# Altium project BLDC.PrjPcb (part 2 of 2)

## Sheet BLDC_Page2.SchDoc
size B; Date: Not shown in title block; ApprovedBy: Not shown in title block; CheckedBy: Not shown in title block; Author: Not shown in title block; CompanyName: Not shown in title block; DrawnBy: Erhan YILMAZ; Engineer: Not shown in title block; Organization: Not shown in title block; Address1: Not shown in title block; Address2: Not shown in title block; Address3: Not shown in title block; Address4: Not shown in title block; DocumentNumber: 4; Revision: 1; SheetNumber: 4; SheetTotal: 4; PageSetup: Record=PageOptions|CenterHorizontal=True|CenterVertical=True|PrintScale=1.00|XCorrection=1.00|YCorrection=1.00|PrintKind=0|BorderSize=5000000|LeftOffset=0|BottomOffset=0|Orientation=2|PaperLength=1000|PaperWidth=1000|Scale=100|PaperSource=15|PrintQuality=600|MediaType=1|DitherType=10|PaperKind=Letter|PrintScaleMode=1; LogoLocation: C:\Users\erhan\Desktop\emob_bldc\design\hardware\altium\templates\schematic\Beuth-Logo.bmp; SheetTitle: Power Stage; DesignedBy: Erhan YILMAZ; PRJNAME: Beuth EMOB BLDC Controller Derived from TI TIDA-010056; CurrentTime: Not shown in title block; CurrentDate: Not shown in title block; Time: Not shown in title block; DocumentFullPathAndName: Not shown in title block; DocumentName: Not shown in title block; ModifiedDate: Not shown in title block; ImagePath: Not shown in title block
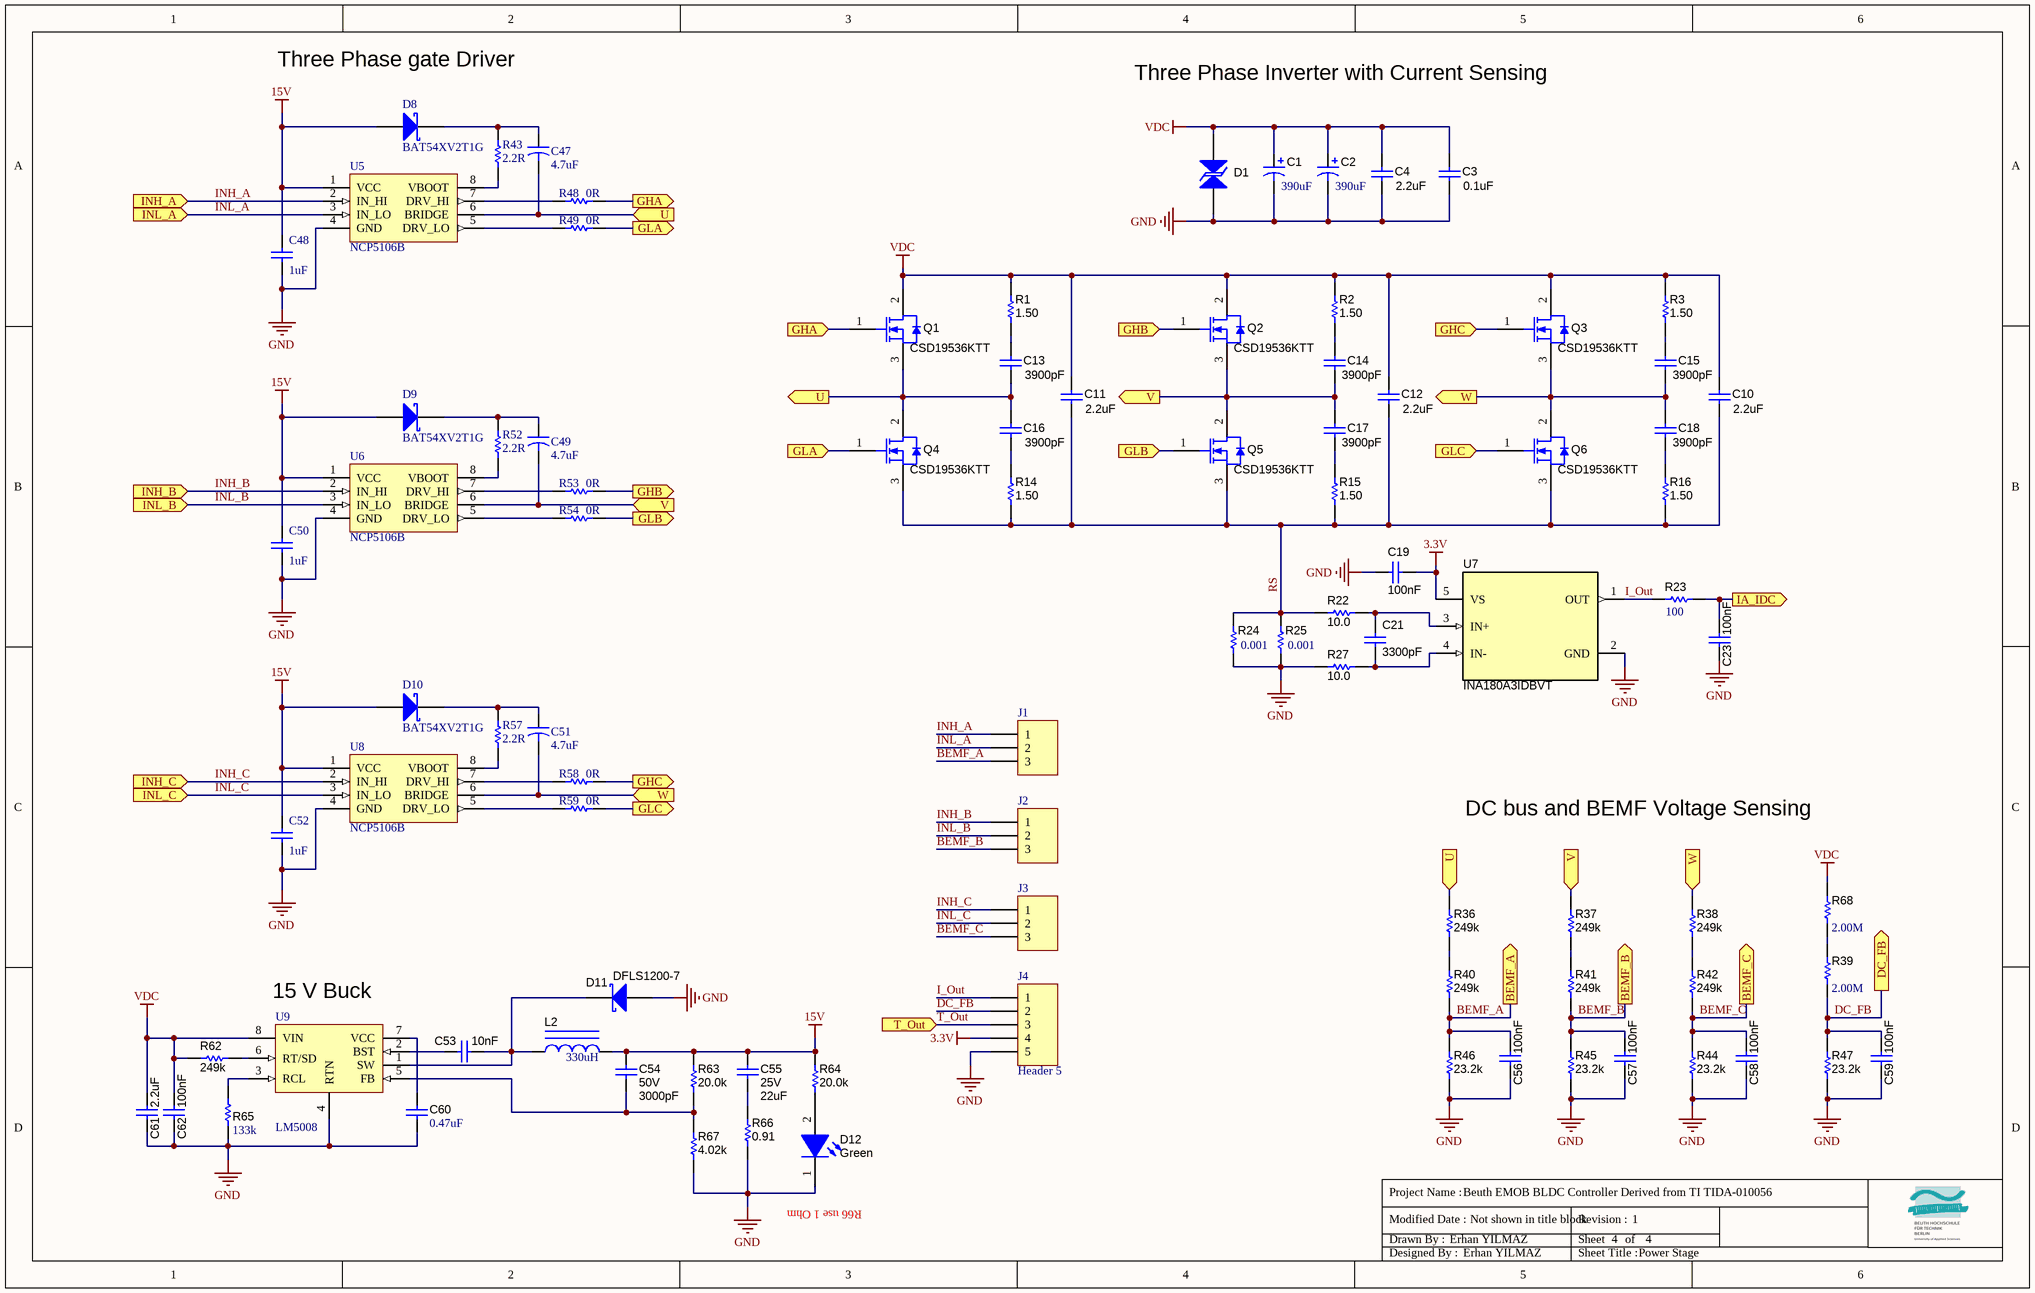
[diagram p2: BLDC_Page2.SchDoc]

### Parts
C1  ValueDisplayed: 390uF  [YXJ_1600x2500]  (hidden comment: EEU-FS2A391)
C2  ValueDisplayed: 390uF  [YXJ_1600x2500]  (hidden comment: EEU-FS2A391)
C3  ValueDisplayed: 0.1uF  [1206]  (hidden comment: C3216X7R2A104K160AA)
C4  ValueDisplayed: 2.2uF  [1206]  (hidden comment: CL31B225KCHSNNE)
C10  ValueDisplayed: 2.2uF  [1206]  (hidden comment: CL31B225KCHSNNE)
C11  ValueDisplayed: 2.2uF  [1206]  (hidden comment: CL31B225KCHSNNE)
C12  ValueDisplayed: 2.2uF  [1206]  (hidden comment: CL31B225KCHSNNE)
C13  ValueDisplayed: 3900pF  [1206]  (hidden comment: 12061C392KAZ2A)
C14  ValueDisplayed: 3900pF  [1206]  (hidden comment: 12061C392KAZ2A)
C15  ValueDisplayed: 3900pF  [1206]  (hidden comment: 12061C392KAZ2A)
C16  ValueDisplayed: 3900pF  [1206]  (hidden comment: 12061C392KAZ2A)
C17  ValueDisplayed: 3900pF  [1206]  (hidden comment: 12061C392KAZ2A)
C18  ValueDisplayed: 3900pF  [1206]  (hidden comment: 12061C392KAZ2A)
C19  ValueDisplayed: 100nF  [0603]  (hidden comment: GRM1885C1H302JA01D)
C21  3300pF  [0603]
C23  ValueDisplayed: 100nF  [0603]  (hidden comment: GRM1885C1H302JA01D)
C47  4.7uF  [0805_HV]
C48  1uF  [0603]
C49  4.7uF  [0805_HV]
C50  1uF  [0603]
C51  4.7uF  [0805_HV]
C52  1uF  [0603]
C53  Cap_F: 10nF  [0603]  (hidden comment: 885012206114)
C54  VDC_V: 50V  ValueDisplayed: 3000pF  [0603]  (hidden comment: CAP, CERM, 3000 pF, 50 V, +/- 5%, C0G/NP0, 0603)
C55  VDC_V: 25V  ValueDisplayed: 22uF  [1210_280]  (hidden comment: C2012X7R1H225K125AC)
C56  ValueDisplayed: 100nF  [0603]  (hidden comment: GRM1885C1H302JA01D)
C57  ValueDisplayed: 100nF  [0603]  (hidden comment: GRM1885C1H302JA01D)
C58  ValueDisplayed: 100nF  [0603]  (hidden comment: GRM1885C1H302JA01D)
C59  ValueDisplayed: 100nF  [0603]  (hidden comment: GRM1885C1H302JA01D)
C60  ValueDisplayed: 0.47uF  [0603]  (hidden comment: CGB2A1X5R1C474K033BC)
C61  ValueDisplayed: 2.2uF  [1206]  (hidden comment: C2012X7R1H225K125AC)
C62  ValueDisplayed: 100nF  [0603]  (hidden comment: GRM1885C1H302JA01D)
D1  SMBJ70CA-13-F  [SMB-Bi]  (value not drawn)
D8  BAT54XV2T1G  [SOD-523]
D9  BAT54XV2T1G  [SOD-523]
D10  BAT54XV2T1G  [SOD-523]
D11  DFLS1200-7  [PowerDI123]
D12  value Green  [WL-SMCW_GREEN]  (hidden comment: LED_A2_K1)
J1  Header 3  [HDR1X3]  (value not drawn)
J2  Header 3  [HDR1X3]  (value not drawn)
J3  Header 3  [HDR1X3]  (value not drawn)
J4  Header 5  [HDR1X5]
L2  ValueDisplayed: 330uH  [SDR0604]  (hidden comment: SDR0604-331KL)
Q1  CSD19536KTT  [KTT0002A]
Q2  CSD19536KTT  [KTT0002A]
Q3  CSD19536KTT  [KTT0002A]
Q4  CSD19536KTT  [KTT0002A]
Q5  CSD19536KTT  [KTT0002A]
Q6  CSD19536KTT  [KTT0002A]
R1  ValueDisplayed: 1.50  [1206]  (hidden comment: CRCW12061R50FKEA)
R2  ValueDisplayed: 1.50  [1206]  (hidden comment: CRCW12061R50FKEA)
R3  ValueDisplayed: 1.50  [1206]  (hidden comment: CRCW12061R50FKEA)
R14  ValueDisplayed: 1.50  [1206]  (hidden comment: CRCW12061R50FKEA)
R15  ValueDisplayed: 1.50  [1206]  (hidden comment: CRCW12061R50FKEA)
R16  ValueDisplayed: 1.50  [1206]  (hidden comment: CRCW12061R50FKEA)
R22  ValueDisplayed: 10.0  [0603]  (hidden comment: CRCW040210R0FKED)
R23  ValueDisplayed: 100  [0603]  (hidden comment: ERJ-2GEJ101X)
R24  ValueDisplayed: 0.001  [CRE2512-R1_R4]  (hidden comment: CRE2512-FZ-R001E-3)
R25  value 0.001  [CRE2512-R1_R4]  (hidden comment: CRE2512-FZ-R001E-3)
R27  ValueDisplayed: 10.0  [0603]  (hidden comment: CRCW040210R0FKED)
R36  ValueDisplayed: 249k  [0603]  (hidden comment: RC0603FR-07249KL)
R37  ValueDisplayed: 249k  [0603]  (hidden comment: RC0603FR-07249KL)
R38  ValueDisplayed: 249k  [0603]  (hidden comment: RC0603FR-07249KL)
R39  ValueDisplayed: 2.00M  [0603]  (hidden comment: CRCW06032M00FKED)
R40  ValueDisplayed: 249k  [0603]  (hidden comment: RC0603FR-07249KL)
R41  ValueDisplayed: 249k  [0603]  (hidden comment: RC0603FR-07249KL)
R42  ValueDisplayed: 249k  [0603]  (hidden comment: RC0603FR-07249KL)
R43  2.2R  [0603]
R44  ValueDisplayed: 23.2k  [0603]  (hidden comment: RC0603FR-0723K2L)
R45  ValueDisplayed: 23.2k  [0603]  (hidden comment: RC0603FR-0723K2L)
R46  ValueDisplayed: 23.2k  [0603]  (hidden comment: RC0603FR-0723K2L)
R47  ValueDisplayed: 23.2k  [0603]  (hidden comment: RC0603FR-0723K2L)
R48  0R  [0603]
R49  0R  [0603]
R52  2.2R  [0603]
R53  0R  [0603]
R54  0R  [0603]
R57  2.2R  [0603]
R58  0R  [0603]
R59  0R  [0603]
R62  ValueDisplayed: 249k  [0603]  (hidden comment: RC0603FR-07249KL)
R63  ValueDisplayed: 20.0k  [0603]  (hidden comment: CRCW060320K0FKED)
R64  ValueDisplayed: 20.0k  [0603]  (hidden comment: CRCW060320K0FKED)
R65  ValueDisplayed: 133k  [0603]  (hidden comment: AC0402FR-07133KL)
R66  ValueDisplayed: 0.91  [0603]  (hidden comment: ERJ-2BQFR91X)
R67  ValueDisplayed: 4.02k  [0603]  (hidden comment: RC0402FR-074K02L)
R68  ValueDisplayed: 2.00M  [0603]  (hidden comment: CRCW06032M00FKED)
U5  NCP5106B  [SO-8_L]
U6  NCP5106B  [SO-8_L]
U7  PartNumber: INA180A3IDBVT  [sot23-5]  (hidden comment: INA180A3IDBV)
U8  NCP5106B  [SO-8_L]
U9  LM5008  [VSSOP8]

### Ports
BEMF_A (out), BEMF_B (out), BEMF_C (out), DC_FB (out), GHA (in), GHA (out), GHB (in), GHB (out), GHC (in), GHC (out), GLA (in), GLA (out), GLB (in), GLB (out), GLC (in), GLC (out), IA_IDC (out), INH_A (in), INH_B (in), INH_C (in), INL_A (in), INL_B (in), INL_C (in), T_Out (in), U (in), U (out), V (in), V (out), W (in), W (out)

### Nets
3.3V: C19.2 J4.4 U7.5(VS)
15V: C48.2 C50.2 C52.2 C54.1 C55.1 D8.1(A) D9.1(A) D10.1(A) L2.2 R63.2 R64.2 U5.1(VCC) U6.1(VCC) U8.1(VCC)
GND: C1.2(-) C2.2(-) C3.2 C4.2 C19.1 C23.2 C48.1 C50.1 C52.1 C56.2 C57.2 C58.2 C59.2 C60.1 C61.2 C62.2 D1.1 D11.2(A) D12.1(K) J4.5 R24.1 R25.1 R27.1 R44.1 R45.1 R46.1 R47.1 R65.1 R66.1 R67.1 U5.4(GND) U6.4(GND) U7.2(GND) U8.4(GND) U9.4(RTN)
VDC: C1.1(+) C2.1(+) C3.1 C4.1 C10.1 C11.1 C12.1 C61.1 C62.1 D1.2 Q1.2(D) Q2.2(D) Q3.2(D) R1.2 R2.2 R3.2 R62.2 R68.2 U9.8(VIN)
BEMF_A: C56.1 J1.3 R40.1 R46.2 ; port BEMF_A
BEMF_B: C57.1 J2.3 R41.1 R45.2 ; port BEMF_B
BEMF_C: C58.1 J3.3 R42.1 R44.2 ; port BEMF_C
DC_FB: C59.1 J4.2 R39.1 R47.2 ; port DC_FB
GHA: Q1.1(G) R48.1 ; port GHA
GHB: Q2.1(G) R53.1 ; port GHB
GHC: Q3.1(G) R58.1 ; port GHC
GLA: Q4.1(G) R49.1 ; port GLA
GLB: Q5.1(G) R54.1 ; port GLB
GLC: Q6.1(G) R59.1 ; port GLC
I_Out: J4.1 R23.1 U7.1(OUT)
IA_IDC: C23.1 R23.2 ; port IA_IDC
INH_A: J1.1 U5.2(IN_HI) ; port INH_A
INH_B: J2.1 U6.2(IN_HI) ; port INH_B
INH_C: J3.1 U8.2(IN_HI) ; port INH_C
INL_A: J1.2 U5.3(IN_LO) ; port INL_A
INL_B: J2.2 U6.3(IN_LO) ; port INL_B
INL_C: J3.2 U8.3(IN_LO) ; port INL_C
RS: C10.2 C11.2 C12.2 Q4.3(S) Q5.3(S) Q6.3(S) R14.1 R15.1 R16.1 R22.1 R24.2 R25.2
T_Out: J4.3 ; port T_Out
U: C13.2 C16.1 C47.2 Q1.3(S) Q4.2(D) R36.2 U5.6(BRIDGE) ; port U
V: C14.2 C17.1 C49.2 Q2.3(S) Q5.2(D) R37.2 U6.6(BRIDGE) ; port V
W: C15.2 C18.1 C51.2 Q3.3(S) Q6.2(D) R38.2 U8.6(BRIDGE) ; port W
NetC13_1: C13.1 R1.1
NetC14_1: C14.1 R2.1
NetC15_1: C15.1 R3.1
NetC16_2: C16.2 R14.2
NetC17_2: C17.2 R15.2
NetC18_2: C18.2 R16.2
NetC21_1: C21.1 R22.2 U7.3(IN+)
NetC21_2: C21.2 R27.2 U7.4(IN-)
NetC47_1: C47.1 D8.2(K) R43.2
NetC49_1: C49.1 D9.2(K) R52.2
NetC51_1: C51.1 D10.2(K) R57.2
NetC53_1: C53.1 U9.2(BST)
NetC53_2: C53.2 D11.1(K) L2.1 U9.1(SW)
NetC54_2: C54.2 R63.1 R67.2 U9.5(FB)
NetC55_2: C55.2 R66.2
NetC60_2: C60.2 U9.7(VCC)
NetD12_2: D12.2(A) R64.1
NetR36_1: R36.1 R40.2
NetR37_1: R37.1 R41.2
NetR38_1: R38.1 R42.2
NetR39_2: R39.2 R68.1
NetR43_1: R43.1 U5.8(VBOOT)
NetR48_2: R48.2 U5.7(DRV_HI)
NetR49_2: R49.2 U5.5(DRV_LO)
NetR52_1: R52.1 U6.8(VBOOT)
NetR53_2: R53.2 U6.7(DRV_HI)
NetR54_2: R54.2 U6.5(DRV_LO)
NetR57_1: R57.1 U8.8(VBOOT)
NetR58_2: R58.2 U8.7(DRV_HI)
NetR59_2: R59.2 U8.5(DRV_LO)
NetR62_1: R62.1 U9.6(RT/SD)
NetR65_2: R65.2 U9.3(RCL)

### Notes on the sheet
- Three Phase gate Driver
- Three Phase Inverter with Current Sensing
- DC bus and BEMF Voltage Sensing
- (near U9) 15 V Buck
- R66 use 1 Ohm
- Project Name :
- Modified Date :
- Drawn By :
- Revision :
- Sheet
- of
- Designed By :
- Sheet Title :

### Library data of the parts
C1 C2 = CMP-0009783-2: CAP ALUM 390UF 20% 100V THRUHOLE; Manufacturer: Panasonic Electronic Components; TaMin_C: -40°C; ESR_ohm: 0.025; Polarized: Y; SizeAreaWB_mm2: 324; Value1: 0.025 ohm; U/M: EA; TaMax_C: 105°C; SizeZ_mm: 27; SizeX_mm: 16; Cap_Case: 16x257; SizeArea_mm2: 256; CompType: Capacitor; AEC Qualified: N; Cap_F: 390µF; IRMS_A: 2.5A; AEC Category: Q200; Publisher: Texas Instruments; Supplier 2: Newark; Supplier 3: Farnell; RoHS: Y; MountType: TH; Value: 390uF; Supplier 1: Digi-Key; PackageReference: D16xL27mm; Tolerance_%: 20%; SizeY_mm: 16; Value2: 100V; LatestRevisionDate: 2017-03-09; PartNumber: EEU-FS2A391; Series: YXJ; VDC_V: 100V; ComponentLink1Description: Datasheet link; AEC Grade: N/A; Supplier Part Number 1: PCE5237-ND; Technology: AL; ComponentLink1URL: http://www.rubycon.co.jp/en/catalog/e_pdfs/aluminum/e_yxj.pdf; Parameter 1: *
C3 = CMP-0008709-2: CAP, CERM, 0.1 uF, 100 V, +/- 10%, X7R, 1206; Manufacturer: TDK; TaMin_C: -55°C; ESR_ohm: 0.030343; Polarized: N; SizeAreaWB_mm2: 10.92; Value1: 0.030343 ohm; U/M: EA; Value: 0.1uF; TaMax_C: 125°C; SizeZ_mm: 1.8; SizeX_mm: 3.2; SizeY_mm: 1.6; Cap_Case: 1206_180; Value2: 100V; SizeArea_mm2: 5.12; Cap_F: 100nF; IRMS_A: 1.33802A; AEC Category: Q200; Supplier Part Number 2: 810-C3216X7R2A104K160AA; Publisher: Texas Instruments; Supplier 2: Mouser; TempCo: X7R; Published: 2008-06-19; RoHS: Y; MountType: SMT; Supplier 1: Digi-Key; PackageReference: 1206; Tolerance_%: 10%; CompType: Capacitor; LatestRevisionDate: 2017-03-09; PartNumber: C3216X7R2A104K160AA; AEC Qualified: N; VDC_V: 100V; ComponentLink1Description: Datasheet link; AEC Grade: N/A; Supplier Part Number 1: 445-1377-1-ND; Technology: Ceramic; ComponentLink1URL: https://product.tdk.com/en/search/capacitor/ceramic/mlcc/info?part_no=C3216X7R2A104K160AA
C4 C10-C12 = CMP-0008756-2: CAP CER 2.2UF 100V X7R 1206; Manufacturer: Samsung Electro-Mechanics; TaMin_C: -55°C; Polarized: N; SizeAreaWB_mm2: 10.92; Value1: Unknown; U/M: EA; TaMax_C: 125°C; Tolerance_%: 10%; SizeZ_mm: 1.35; SizeX_mm: 3.2; SizeY_mm: 1.6; SizeArea_mm2: 5.12; AEC Category: Q200; Publisher: Texas Instruments; Supplier 2: Mouser; TempCo: X7R; Supplier 3: Farnell; Published: 2008-06-19; RoHS: Y; MountType: SMT; Value: 2.2uF; Supplier 1: Digi-Key; PackageReference: 1206; Cap_Case: 1206; Value2: 100V; CompType: Capacitor; LatestRevisionDate: 2017-03-09; PartNumber: CL31B225KCHSNNE; AEC Qualified: ?; Cap_F: 2.2uF; VDC_V: 100V; ComponentLink1Description: Datasheet link; Supplier Part Number 1: 1276-3138-1-ND; Technology: Ceramic; ComponentLink1URL: http://www.yageo.com/documents/recent/UPY-GPHC_X7R_6.3V-to-50V_7.pdf
C13-C18 = CMP-0008756-2: CAP CER 3900PF 100V X7R 1206; Manufacturer: AVX Corporation; TaMin_C: -55°C; Polarized: N; SizeAreaWB_mm2: 10.92; Value1: Unknown; U/M: EA; TaMax_C: 125°C; Tolerance_%: 10%; SizeZ_mm: 1.35; SizeX_mm: 3.2; SizeY_mm: 1.6; SizeArea_mm2: 5.12; Cap_F: 3.9nF; AEC Category: Q200; Publisher: Texas Instruments; Supplier 2: Mouser; TempCo: X7R; Supplier 3: Farnell; Published: 2008-06-19; RoHS: Y; MountType: SMT; Value: 3900pF; Supplier 1: Digi-Key; PackageReference: 1206; Cap_Case: 1206; Value2: 100V; CompType: Capacitor; LatestRevisionDate: 2017-03-09; PartNumber: 12061C392KAZ2A; AEC Qualified: ?; VDC_V: 100V; ComponentLink1Description: Datasheet link; Supplier Part Number 1: 478-6364-1-ND; Technology: Ceramic; ComponentLink1URL: http://www.yageo.com/documents/recent/UPY-GPHC_X7R_6.3V-to-50V_7.pdf
C19 C23 C56-C59 C62 = CMP-0007207-4: CAP, CERM, 100 nF, 100 V, +/- 5%, C0G/NP0, 0603; Manufacturer: MuRata; TaMin_C: -55°C; Polarized: N; SizeAreaWB_mm2: 4.68; Value1: Unknown; U/M: EA; Value: 3000pF; TaMax_C: 125°C; SizeZ_mm: 1; SizeX_mm: 1.6; SizeY_mm: 0.8; Value2: 100V; SizeArea_mm2: 1.28; Cap_F: 3nF; AEC Category: Q200; Supplier Part Number 2: 81-GRM1885C1H302JA1D; Publisher: Texas Instruments; Supplier 2: Mouser; TempCo: C0G/NP0; Published: 2008-06-19; RoHS: Y; MountType: SMT; Supplier 1: Digi-Key; PackageReference: 0603; Tolerance_%: 5%; Cap_Case: 0603; CompType: Capacitor; LatestRevisionDate: 2017-03-09; PartNumber: GRM1885C1H302JA01D; AEC Qualified: ?; VDC_V: 100V; ComponentLink1Description: Datasheet link; Supplier Part Number 1: GRM1885C1H302JA01D-ND; Technology: Ceramic; ComponentLink1URL: http://search.murata.co.jp/Ceramy/PnsearchViewAction.do?HnOFG=ON&HnNFG=ON&SEL_CNT=50&sLang=en&sKey=GRM1885C1H302JA01D&x=9&y=9&search=startwith
C21 = CMP-0006688-2: CAP, CERM, 3300 pF, 50 V, +/- 10%, X7R, 0603; Manufacturer: MuRata; PartNumber: GRM155R71H332KA01D; TaMin_C: -55°C; Polarized: N; SizeAreaWB_mm2: 3; Value1: Unknown; U/M: EA; TaMax_C: 125°C; SizeZ_mm: 0.6; SizeX_mm: 1; SizeY_mm: 0.5; Value2: 50V; Cap_F: 3.3nF; AEC Category: Q200; Supplier Part Number 2: 81-GRM36X332K50; Publisher: Texas Instruments; Supplier 2: Mouser; TempCo: X7R; Published: 2008-06-19; RoHS: Y; MountType: SMT; Value: 3300pF; Supplier 1: Digi-Key; PackageReference: 0402; Tolerance_%: 10%; Cap_Case: 0603; SizeArea_mm2: 0.5; CompType: Capacitor; LatestRevisionDate: 2017-03-09; AEC Qualified: ?; VDC_V: 50V; ComponentLink1Description: Datasheet link; Supplier Part Number 1: 490-3248-1-ND; Technology: Ceramic; ValueDisplayed: 3300pF; ComponentLink1URL: http://search.murata.co.jp/Ceramy/PnsearchViewAction.do?HnOFG=ON&HnNFG=ON&SEL_CNT=50&sLang=en&sKey=GRM155R71H332KA01D&x=9&y=9&search=startwith
C47 C49 C51 = Cap2: 4.7uF 25V Tantalum SMD Capacitor; Manufacturer: AVX; Published: 23-Sep-2002; PackageReference: CAPR5-4X5; Publisher: Altium Limited; PackageDescription: Capacitor; 2 Leads; Value: 4.7uF; Buy Link: https://www.mouser.de/ProductDetail/AVX/TCJD475M100R0250; Datasheet: https://www.mouser.de/datasheet/2/40/tcj-776064.pdf
C48 = Cap Semi: 1uF %10 35V 0603; Published: 8-Jun-2000; LatestRevisionDate: 29-May-2009; LatestRevisionNote: IPC-7351 Footprint Added.; PackageReference: 0603; Publisher: Altium Limited; PackageDescription: Chip Capacitor; Value: 1uF
C50 C52 = Cap Semi: 1uF %10 35V  0603; Published: 8-Jun-2000; LatestRevisionDate: 29-May-2009; LatestRevisionNote: IPC-7351 Footprint Added.; PackageReference: 0603; Publisher: Altium Limited; PackageDescription: Chip Capacitor; Value: 1uF
C53 = CMP-0079993-1: CAP, CERM, 0.01 µF, 100 V,+/- 10%, X7R, 0603; Manufacturer: Wurth Elektronik; TaMin_C: -55°C; Polarized: N; SizeAreaWB_mm2: 4.68; U/M: EA; Value: 0.01uF; TaMax_C: 105°C; SizeZ_mm: 1; SizeX_mm: 1.6; SizeY_mm: 0.8; Value2: 100V; SizeArea_mm2: 1.28; AEC Category: Q200; ValueDisplayed: 0.01µF; ComponentLink1URL: http://katalog.we-online.de/pbs/datasheet/885012206114.pdf; Supplier Part Number 2: 2812368; Supplier 2: Farnell; TempCo: X7R; RoHS: Y; MountType: SMT; Supplier 1: Newark; PackageReference: 0603; Tolerance_%: 10%; Cap_Case: 0603; CompType: Capacitor; PartNumber: 885012206114; AEC Qualified: N; VDC_V: 100V; ComponentLink1Description: Datasheet link; AEC Grade: N/A; Supplier Part Number 1: 45AC8565; Technology: Ceramic
C54 = CMP-0007207-4: Manufacturer: MuRata; PartNumber: GRM1885C1H302JA01D; TaMin_C: -55°C; Polarized: N; SizeAreaWB_mm2: 4.68; Value1: Unknown; U/M: EA; Value: 3000pF; TaMax_C: 125°C; SizeZ_mm: 1; SizeX_mm: 1.6; SizeY_mm: 0.8; SizeArea_mm2: 1.28; Cap_F: 3nF; AEC Category: Q200; Supplier Part Number 2: 81-GRM1885C1H302JA1D; Publisher: Texas Instruments; Supplier 2: Mouser; TempCo: C0G/NP0; Published: 2008-06-19; RoHS: Y; MountType: SMT; Supplier 1: Digi-Key; PackageReference: 0603; Tolerance_%: 5%; Cap_Case: 0603; Value2: 50V; CompType: Capacitor; LatestRevisionDate: 2017-03-09; AEC Qualified: ?; ComponentLink1Description: Datasheet link; Supplier Part Number 1: GRM1885C1H302JA01D-ND; Technology: Ceramic; ComponentLink1URL: http://search.murata.co.jp/Ceramy/PnsearchViewAction.do?HnOFG=ON&HnNFG=ON&SEL_CNT=50&sLang=en&sKey=GRM1885C1H302JA01D&x=9&y=9&search=startwith
C55 = CMP-0007877-2: CAP, CERM, 22 uF, 25 V, +/- 10%, X7R, 1210; Manufacturer: TDK; TaMin_C: -55°C; ESR_ohm: 3.66m; Polarized: N; SizeAreaWB_mm2: 6.75; Value1: 0.00366 ohm; U/M: EA; Value: 22uF; TaMax_C: 125°C; SizeZ_mm: 1.45; SizeX_mm: 2; SizeY_mm: 1.25; Cap_Case: 1210; SizeArea_mm2: 2.5; Cap_F: 22µF; IRMS_A: 3.41207A; AEC Category: Q200; Supplier Part Number 2: 04X3290; Publisher: Texas Instruments; Supplier 2: Newark; Supplier Part Number 3: 2346945; TempCo: X7R; Supplier 3: Farnell; Published: 2008-06-19; RoHS: Y; MountType: SMT; Supplier 1: Digi-Key; PackageReference: 0805; Tolerance_%: 10%; Value2: 25V; CompType: Capacitor; LatestRevisionDate: 2017-03-09; PartNumber: C2012X7R1H225K125AC; AEC Qualified: N; ComponentLink1Description: Datasheet link; AEC Grade: N/A; Supplier Part Number 1: 445-5968-1-ND; Technology: Ceramic; ComponentLink1URL: https://product.tdk.com/en/search/capacitor/ceramic/mlcc/info?part_no=C2012X7R1H225K125AC
C60 = CMP-0006600-2: CAP CER 0.47UF 16V X5R 0603; Manufacturer: TDK Corporation; TaMin_C: -55°C; Polarized: N; SizeAreaWB_mm2: 3; Value1: Unknown; U/M: EA; TaMax_C: 85°C; Tolerance_%: 10%; SizeZ_mm: 0.6; SizeX_mm: 1; SizeY_mm: 0.5; Cap_F: 470nF; AEC Category: Q200; Publisher: Texas Instruments; TempCo: X5R; Published: 2008-06-19; RoHS: Y; MountType: SMT; Value: 0.47uF; PackageReference: 0402; Cap_Case: 0603; Value2: 16V; SizeArea_mm2: 0.5; CompType: Capacitor; LatestRevisionDate: 2017-03-09; PartNumber: CGB2A1X5R1C474K033BC; AEC Qualified: ?; VDC_V: 16V; ComponentLink1Description: Datasheet link; Technology: Ceramic; ComponentLink1URL: http://psearch.murata.com/capacitor/product/GRM155R61C474KE01%23.pdf; Supplier 1: Digikey; Supplier Part Number 1: 445-13183-1-ND
C61 = CMP-0007877-2: CAP, CERM, 2.2 uF, 100 V, +/- 10%, X7R, 1206; Manufacturer: TDK; TaMin_C: -55°C; ESR_ohm: 3.66m; Polarized: N; SizeAreaWB_mm2: 6.75; Value1: 0.00366 ohm; U/M: EA; Value: 2.2uF; TaMax_C: 125°C; SizeZ_mm: 1.45; SizeX_mm: 2; SizeY_mm: 1.25; Value2: 100V; SizeArea_mm2: 2.5; Cap_F: 2.2µF; IRMS_A: 3.41207A; AEC Category: Q200; Supplier Part Number 2: 04X3290; Publisher: Texas Instruments; Supplier 2: Newark; Supplier Part Number 3: 2346945; TempCo: X7R; Supplier 3: Farnell; Published: 2008-06-19; RoHS: Y; MountType: SMT; Supplier 1: Digi-Key; PackageReference: 1206; Tolerance_%: 10%; Cap_Case: 1206; CompType: Capacitor; LatestRevisionDate: 2017-03-09; PartNumber: C2012X7R1H225K125AC; AEC Qualified: N; VDC_V: 100V; ComponentLink1Description: Datasheet link; AEC Grade: N/A; Supplier Part Number 1: 445-5968-1-ND; Technology: Ceramic; ComponentLink1URL: https://product.tdk.com/en/search/capacitor/ceramic/mlcc/info?part_no=C2012X7R1H225K125AC
D1 = CMP-0005587-3: Diode, TVS, Bi, 70 V, SMB; Manufacturer: Diodes Inc.; Value: 70V; AEC Category: Q101; SizeX_mm: 5.6; SizeY_mm: 3.81; Ppk: 600W; SizeZ_mm: 2.6; SizeArea_mm2: 21.336; SizeAreaWB_mm2: 44.156; PackageReference: SMB; PartNumber: SMBJ70CA-13-F; AEC Qualified: ?; ComponentLink1URL: http://www.diodes.com/datasheets/ds19002.pdf; CompType: TVS; RoHS: Y; MountType: SMT; Value1: 600W; VRWM: 70V; ComponentLink1Description: Datasheet link
D8-D10 = D Schottky: Schottky Diode; Published: 8-Jun-2000; LatestRevisionDate: 17-Jul-2002; LatestRevisionNote: Re-released for DXP Platform.; PackageReference: SMB; Publisher: Altium Limited; PackageDescription: DO-214-AA/SMB; 2 C-Bend Leads; Body 5.3 x 3.6 mm, inc. leads (LxW); Code_JEDEC: DO-214-AA; Value: BAT54XV2T1G
D11 = CMP-0028517-1: Diode, Schottky, 200 V, 1 A, PowerDI123; Manufacturer: Diodes Inc.; Io_A: 1A; Green_Lifecycle: Active; SizeAreaWB_mm2: 13.066; Vr_V: 200V; Green_REACh: Passed; TJmax_C: 175°C; U/M: EA; Value: 200V; SizeZ_mm: 0.98; SizeX_mm: 3.7; SizeY_mm: 1.78; Vf_V: 8.5dV; Value2: 0.85V; SizeArea_mm2: 6.586; AEC Category: Q101; RJC_CperW: 7; ComponentLink1URL: http://www.diodes.com/datasheets/ds30628.pdf; Supplier Part Number 2: 621-DFLS1200-F; Publisher: Texas Instruments; Supplier 2: Mouser; Supplier Part Number 3: 1713890; Supplier 3: Farnell; Published: 2008-06-26; RoHS: Y; Value1: 1A; MountType: SMT; Green_EU RoHS-2: Passed; Supplier 1: Digi-Key; Green_EU RoHS: Passed with Exemption; PackageReference: PowerDI123; CompType: Diode; Type: Schottky; LatestRevisionDate: 2017-05-08; PartNumber: DFLS1200-7; AEC Qualified: ?; ComponentLink1Description: Datasheet link; Supplier Part Number 1: DFLS1200DICT-ND
D12 = CMP-0002905-1: LED, Green, SMD; Manufacturer: Wurth Elektronik; PartNumber: 150060GS75000; Type: InGaN; Vf_V: 3.2V; Io_A: 20mA; Tjmax_C: 85°C; Value1: W; Angle: 140; U/M: EA; CompType: LED; MountType: SMT; RoHS: Y; PackageReference: LED_0603; Value2: 3.2V; Color: Green; Published: 2008-07-11; Publisher: Texas Instruments; ComponentLink1URL: http://katalog.we-online.de/led/datasheet/150060GS75000.pdf; ComponentLink1Description: Datasheet link; LatestRevisionDate: 2017-03-09; Supplier 1: Digi-Key; Supplier Part Number 1: 732-4971-1-ND; Supplier 2: Newark; Supplier Part Number 2: 95W3794; Supplier 3: Mouser; Supplier Part Number 3: 710-150060GS75000
J1-J3 = Header 3: Header, 3-Pin; LatestRevisionDate: 17-Jul-2002; LatestRevisionNote: Re-released for DXP Platform.; Publisher: Altium Limited
J4 = Header 5: Header, 5-Pin; LatestRevisionDate: 17-Jul-2002; LatestRevisionNote: Re-released for DXP Platform.; Publisher: Altium Limited
L2 = CMP-0056063-1: Inductor, Drum Core, Ferrite, 330 uH, 0.27 A, 2.25 ohm, SMD; Manufacturer: Bourns; Isat: 0.42A @ 10% inductance drop; Irms: 0.27A @ 40C rise; Green_Lifecycle: Active; SizeAreaWB_mm2: 60.84; DCR_ohm: 2.25; Green_REACh: Passed; Value: 330uH; Imax_A: 270mA; SizeZ_mm: 4.8; SizeX_mm: 5.8; Value2: 0.27A; SizeArea_mm2: 33.64; Ind_H: 330µH; AEC Category: Q200; ComponentLink1URL: http://www.bourns.com/data/global/pdfs/SDR0604.pdf; Supplier Part Number 2: 1828017; Publisher: Texas Instruments; Supplier 2: Farnell; Published: 2008-06-26; RoHS: Y; Value1: 2.25 ohm; Material: Ferrite; MountType: SMT; Green_EU RoHS-2: Incomplete; Supplier 1: Mouser; Green_EU RoHS: Passed; PackageReference: 5.8x4.8x5.8mm; SizeY_mm: 5.8; CompType: Inductor; LatestRevisionDate: 2017-06-02; PartNumber: SDR0604-331KL; AEC Qualified: ?; ComponentLink1Description: Datasheet link; Supplier Part Number 1: 652-SDR0604-331KL; Technology: Drum Core
Q1-Q6 = CMP-0000966-3: MOSFET, N-CH, 100 V, 200 A, KTT0002A (TO-263-2); Alternate Manufacturer: None; Manufacturer: Texas Instruments; SizeZ_mm: 4.7; ChType: N; Value2: 118 nC; VdsMax_V: 100V; SizeX_mm: 14.3; SizeY_mm: 10.16; Vgs_V: 20V; QgTyp_nC: 118; Value: 100V; SizeArea_mm2: 145.288; AEC Category: Q101; IdsMax_A: 200A; SizeAreaWB_mm2: 198.208; Supplier 2: Mouser; Supplier 1: Digi-Key; Supplier Part Number 1: 296-41136-1-ND; Supplier Part Number 2: 595-CSD19536KTT; PartNumber: CSD19536KTT; ComponentLink1Description: Datasheet link; CompType: MOSFET; AEC Qualified: N; RoHS: Y; PackageReference: KTT0002A; MountType: SMT; ComponentLink1URL: http://www.ti.com/lit/ds/symlink/csd19536ktt.pdf
R1-R3 R14-R16 = CMP-0016763-3: RES, 1.50, 1%, 0.25 W, AEC-Q200 Grade 0, 1206; Manufacturer: Vishay-Dale; Power_W: 250mW; TempCo: 100 ppm/C; Value_Code: 1R50; Value: 1.50; EIA_Code: E96; Res_ohm: 1.5; SizeX_mm: 3.2; SizeY_mm: 1.6; SizeZ_mm: 1.35; Value2: 0.25W; SizeArea_mm2: 5.12; AEC Qualified: Y; VDC_V: 200V; AEC Category: Q200; AEC Grade: 0; Supplier Part Number 2: 71-CRCW1206-1.5-E3; Supplier 2: Mouser; Supplier Part Number 3: 1260858; Supplier 3: Farnell; RoHS: E; Value1: 1%; MountType: SMT; Supplier 1: Newark; PackageReference: 1206; Tolerance_%: 1%; CompType: Resistor; PartNumber: CRCW12061R50FKEA; ComponentLink1Description: Datasheet link; Supplier Part Number 1: 53K1888; Technology: Thick Film; ComponentLink1URL: http://www.vishay.com/docs/20035/dcrcwe3.pdf
R22 R27 = CMP-0025963-3: RES, 10.0, 1%, 0.063 W, AEC-Q200 Grade 0, 0603; Manufacturer: Vishay-Dale; Power_W: 63mW; TempCo: 100 ppm/C; Value_Code: 10R0; Value: 10.0; EIA_Code: E96; Res_ohm: 10; SizeX_mm: 1; SizeY_mm: 0.5; SizeZ_mm: 0.6; Value2: 0.063W; AEC Qualified: Y; VDC_V: 50V; AEC Category: Q200; AEC Grade: 0; Supplier Part Number 2: 52K6600; Supplier 2: Newark; Supplier Part Number 3: 71-CRCW0402-10-E3; Supplier 3: Mouser; RoHS: E; Value1: 1%; MountType: SMT; Supplier 1: Digi-Key; Tolerance_%: 1%; SizeArea_mm2: 0.5; CompType: Resistor; PartNumber: CRCW040210R0FKED; ComponentLink1Description: Datasheet link; Supplier Part Number 1: 541-10.0LCT-ND; Technology: Thick Film; ComponentLink1URL: http://www.vishay.com/docs/20035/dcrcwe3.pdf
  R22: PackageReference: 0603
  R27: PackageReference: 0402
R23 = CMP-0026993-2: RES, 100, 5%, 0.1 W, AEC-Q200 Grade 0, 0603; Manufacturer: Panasonic; Power_W: 100mW; TempCo: 200 ppm/C; Value_Code: 100R; U/M: EA; Value: 100; EIA_Code: E24; SizeX_mm: 1; SizeY_mm: 0.5; SizeZ_mm: 0.6; Value2: 0.1W; AEC Qualified: Y; AEC Grade: 0; AEC Category: Q200; Supplier Part Number 2: 65T8246; Publisher: Texas Instruments; Supplier 2: Newark; Supplier Part Number 3: 2059210; Supplier 3: Farnell; Published: 2008-06-26; RoHS: Y; Value1: 5%; MountType: SMT; Supplier 1: Digi-Key; PackageReference: 0402; Tolerance_%: 5%; Res_ohm: 100; SizeArea_mm2: 0.5; CompType: Resistor; LatestRevisionDate: 2017-03-09; PartNumber: ERJ-2GEJ101X; ComponentLink1Description: Datasheet link; Supplier Part Number 1: P100JCT-ND; Technology: Thick Film; ComponentLink1URL: https://industrial.panasonic.com/cdbs/www-data/pdf/RDA0000/AOA0000C84.pdf
R24 = CMP-0015748-2: RES, 0.001, 1%, 3 W, AEC-Q200 Grade 0, 2512; Manufacturer: Bourns; Power_W: 3W; TempCo: 50 ppm/C; Value_Code: 1L000; U/M: EA; Value: 0.001; EIA_Code: E96; Res_ohm: 1m; SizeX_mm: 6.45; SizeY_mm: 3.35; SizeZ_mm: 0.9; SizeArea_mm2: 21.6075; AEC Qualified: Y; AEC Grade: 0; AEC Category: Q200; Supplier Part Number 2: 78X4866; Publisher: Texas Instruments; Supplier 2: Newark; Supplier Part Number 3: 652-CRE2512FZR001E-3; Supplier 3: Mouser; Published: 2008-06-26; RoHS: Y; Value1: 1%; MountType: SMT; Supplier 1: Digi-Key; PackageReference: 2512; Tolerance_%: 1%; Value2: 3W; CompType: Resistor; LatestRevisionDate: 2017-03-09; PartNumber: CRE2512-FZ-R001E-3; ComponentLink1Description: Datasheet link; Supplier Part Number 1: CRE2512-FZ-R001E-3CT-ND; Technology: Metal Film; ComponentLink1URL: http://www.bourns.com/docs/Product-Datasheets/CRE.pdf
R25 = CMP-0015748-2: RES, 0.001, 1%, 3 W, AEC-Q200 Grade 0, 2512; Manufacturer: Bourns; Power_W: 3W; TempCo: 50 ppm/C; Value_Code: 1L000; U/M: EA; EIA_Code: E96; Res_ohm: 1m; SizeX_mm: 6.45; SizeY_mm: 3.35; SizeZ_mm: 0.9; SizeArea_mm2: 21.6075; AEC Qualified: Y; AEC Grade: 0; AEC Category: Q200; Supplier Part Number 2: 78X4866; Publisher: Texas Instruments; Supplier 2: Newark; Supplier Part Number 3: 652-CRE2512FZR001E-3; Supplier 3: Mouser; Published: 2008-06-26; RoHS: Y; Value1: 1%; MountType: SMT; Supplier 1: Digi-Key; PackageReference: 2512; Tolerance_%: 1%; Value2: 3W; CompType: Resistor; LatestRevisionDate: 2017-03-09; PartNumber: CRE2512-FZ-R001E-3; ComponentLink1Description: Datasheet link; Supplier Part Number 1: CRE2512-FZ-R001E-3CT-ND; Technology: Metal Film; ComponentLink1URL: http://www.bourns.com/docs/Product-Datasheets/CRE.pdf
R36-R38 R40-R42 = CMP-0026193-2: RES SMD 249K OHM 1% 1/16W 0603; Manufacturer: Yageo; Power_W: 63mW; TempCo: 100 ppm/C; EIA_Code: E96; SizeX_mm: 1; SizeY_mm: 0.5; SizeZ_mm: 0.6; Value2: 0.063W; AEC Qualified: Y; VDC_V: 50V; AEC Category: Q200; AEC Grade: 0; ComponentLink1URL: http://www.vishay.com/docs/20035/dcrcwe3.pdf; Supplier 2: Newark; Supplier 3: Mouser; Value_Code: 249k; RoHS: E; Value1: 1%; MountType: SMT; Value: 249k; Supplier 1: Digi-Key; PackageReference: 0603; Tolerance_%: 1%; Res_ohm: 249k; SizeArea_mm2: 0.5; CompType: Resistor; PartNumber: RC0603FR-07249KL; ComponentLink1Description: Datasheet link; Supplier Part Number 1: 311-249KLRCT-ND; Technology: Thick Film
R39 R68 = CMP-0026245-2: RES, 2.00 M, 1%, 0.063 W, AEC-Q200 Grade 0, 0603; Manufacturer: Vishay-Dale; PartNumber: CRCW04022M00FKED; Power_W: 63mW; TempCo: 100 ppm/C; Value_Code: 2M00; Value: 2.00Meg; EIA_Code: E96; Res_ohm: 2M; SizeX_mm: 1; SizeY_mm: 0.5; SizeZ_mm: 0.6; Value2: 0.063W; AEC Qualified: Y; VDC_V: 50V; AEC Category: Q200; AEC Grade: 0; ComponentLink1URL: http://www.vishay.com/docs/20035/dcrcwe3.pdf; Supplier Part Number 2: 52K6816; Supplier 2: Newark; Supplier Part Number 3: 71-CRCW0402-2M-E3; Supplier 3: Mouser; RoHS: E; Value1: 1%; MountType: SMT; Supplier 1: Digi-Key; PackageReference: 0603; Tolerance_%: 1%; SizeArea_mm2: 0.5; CompType: Resistor; ComponentLink1Description: Datasheet link; Supplier Part Number 1: 541-2.00MLCT-ND; Technology: Thick Film
R43 R52 R57 = Res1: 2.2R SMD 0.33w 0603; Published: 8-Jun-2000; LatestRevisionDate: 17-Jul-2002; LatestRevisionNote: Re-released for DXP Platform.; Publisher: Altium Limited; PackageDescription: Axial Device, Thru-Hole; 2 Leads; 0.3 in Pin Spacing; Value: 2.2R
R44-R47 = CMP-0026186-2: RES SMD 23.2K OHM 1% 1/16W 0603; Manufacturer: Yageo; Power_W: 63mW; TempCo: 100 ppm/C; Value_Code: 23k2; EIA_Code: E96; SizeX_mm: 1; SizeY_mm: 0.5; SizeZ_mm: 0.6; Value2: 0.063W; AEC Qualified: Y; VDC_V: 50V; AEC Category: Q200; AEC Grade: 0; ComponentLink1URL: http://www.vishay.com/docs/20035/dcrcwe3.pdf; Supplier 2: Newark; Supplier 3: Mouser; RoHS: E; Value1: 1%; MountType: SMT; Value: 23.2k; Supplier 1: Digi-Key; PackageReference: 0603; Tolerance_%: 1%; Res_ohm: 23.2k; SizeArea_mm2: 0.5; CompType: Resistor; PartNumber: RC0603FR-0723K2L; ComponentLink1Description: Datasheet link; Supplier Part Number 1: YAG3066TR-ND; Technology: Thick Film
R48 R49 R53 R54 R58 R59 = Res1: 0R SMD 0.33w 0603; Published: 8-Jun-2000; LatestRevisionDate: 17-Jul-2002; LatestRevisionNote: Re-released for DXP Platform.; Publisher: Altium Limited; PackageDescription: Axial Device, Thru-Hole; 2 Leads; 0.3 in Pin Spacing; Value: 0R
R62 = CMP-0026193-2: RES SMD 249K OHM 1% 1/16W 0603; Manufacturer: Yageo; PartNumber: RC0402FR-07249KL; Power_W: 63mW; TempCo: 100 ppm/C; EIA_Code: E96; SizeX_mm: 1; SizeY_mm: 0.5; SizeZ_mm: 0.6; Value2: 0.063W; AEC Qualified: Y; VDC_V: 50V; AEC Category: Q200; AEC Grade: 0; ComponentLink1URL: http://www.vishay.com/docs/20035/dcrcwe3.pdf; Supplier 2: Newark; Supplier 3: Mouser; Value_Code: 249k; RoHS: E; Value1: 1%; MountType: SMT; Value: 249k; Supplier 1: Digi-Key; PackageReference: 0603; Tolerance_%: 1%; Res_ohm: 249k; SizeArea_mm2: 0.5; CompType: Resistor; ComponentLink1Description: Datasheet link; Supplier Part Number 1: 311-249KLRCT-ND; Technology: Thick Film
R63 R64 = CMP-0026162-2: RES, 20.0 k, 1%, 0.063 W, AEC-Q200 Grade 0, 0603; Manufacturer: Vishay-Dale; PartNumber: CRCW040220K0FKED; Power_W: 63mW; TempCo: 100 ppm/C; Value_Code: 20k0; Value: 20.0k; EIA_Code: E96; Res_ohm: 20k; SizeX_mm: 1; SizeY_mm: 0.5; SizeZ_mm: 0.6; Value2: 0.063W; AEC Qualified: Y; VDC_V: 50V; AEC Category: Q200; AEC Grade: 0; ComponentLink1URL: http://www.vishay.com/docs/20035/dcrcwe3.pdf; Supplier Part Number 2: 52K6817; Supplier 2: Newark; Supplier Part Number 3: 71-CRCW0402-20K-E3; Supplier 3: Mouser; RoHS: E; Value1: 1%; MountType: SMT; Supplier 1: Digi-Key; PackageReference: 0603; Tolerance_%: 1%; SizeArea_mm2: 0.5; CompType: Resistor; ComponentLink1Description: Datasheet link; Supplier Part Number 1: 541-20.0KLCT-ND; Technology: Thick Film
R65 = CMP-0081046-1: RES, 133 k, 1%, 0.063 W, AEC-Q200 Grade 0, 0603; Manufacturer: Yageo America; Power_W: 63mW; TempCo: 100 ppm/C; SizeAreaWB_mm2: 3; Value: 133k; EIA_Code: E96; SizeX_mm: 1; SizeY_mm: 0.5; SizeZ_mm: 0.6; Value2: 0.063W; AEC Qualified: Y; VDC_V: 50V; AEC Grade: 0; AEC Category: Q200; ComponentLink1URL: http://www.yageo.com/NewPortal/yageodocoutput?fileName=/pdf/R-Chip/PYu-AC_51_RoHS_L_6.pdf; Supplier Part Number 2: 603-AC0402FR-07133KL; Supplier 2: Mouser; Value_Code: 133k; RoHS: Y; Value1: 1%; MountType: SMT; Supplier 1: Digi-Key; PackageReference: 0402; Tolerance_%: 1%; Res_ohm: 133k; SizeArea_mm2: 0.5; CompType: Resistor; PartNumber: AC0402FR-07133KL; ComponentLink1Description: Datasheet link; Supplier Part Number 1: YAG5259CT-ND; Technology: Thick Film
R66 = CMP-0026646-1: RES, 0.91, 1%, 0.125 W, 0603; Manufacturer: Panasonic; Power_W: 125mW; TempCo: 250 ppm/C; Value_Code: R910; U/M: EA; Value: 0.91; EIA_Code: E96; Res_ohm: 9.1d; SizeX_mm: 1; SizeY_mm: 0.5; SizeZ_mm: 0.6; Value2: 0.125W; AEC Category: Q200; ComponentLink1URL: http://www.panasonic.com/industrial/components/pdf/AOA0000CE3.pdf; Supplier Part Number 2: 667-ERJ-2BQFR91X; Publisher: Texas Instruments; Supplier 2: Mouser; Published: 2008-06-26; RoHS: Y; Value1: 1%; MountType: SMT; Supplier 1: Digi-Key; PackageReference: 0402; Tolerance_%: 1%; SizeArea_mm2: 0.5; CompType: Resistor; LatestRevisionDate: 2017-03-09; PartNumber: ERJ-2BQFR91X; AEC Qualified: ?; ComponentLink1Description: Datasheet link; Supplier Part Number 1: P.91AKCT-ND; Technology: Thick Film
R67 = CMP-0026405-2: RES SMD 4.02K OHM 1% 1/16W 0603; Manufacturer: Yageo; Power_W: 63mW; TempCo: 100 ppm/C; Value_Code: 4k02; EIA_Code: E96; SizeX_mm: 1; SizeY_mm: 0.5; SizeZ_mm: 0.6; Value2: 0.063W; AEC Qualified: Y; VDC_V: 50V; AEC Category: Q200; AEC Grade: 0; ComponentLink1URL: http://www.vishay.com/docs/20035/dcrcwe3.pdf; Supplier 2: Newark; Supplier 3: Mouser; RoHS: E; Value1: 1%; MountType: SMT; Value: 4.02k; Supplier 1: Digi-Key; PackageReference: 0402; Tolerance_%: 1%; Res_ohm: 4.02k; SizeArea_mm2: 0.5; CompType: Resistor; PartNumber: RC0402FR-074K02L; ComponentLink1Description: Datasheet link; Supplier Part Number 1: 311-4.02KLRCT-ND; Technology: Thick Film
U5 U6 U8 = NCP5106B: NCP5106B High Voltage, High and Low  Side Driver; Manufacturer: On Semiconductor; Designer: Erhan YILMAZ; Value: NCP5106B; Description: High Voltage, High and Low  Side Driver; Datasheet: https://www.onsemi.com/pub/Collateral/NCP5106-D.PDF
U7 = CMP-0013061-1: Low- and High-Side Measurement, Multichannel, Voltage Output, Current-Sense Amplifier, DBV0005A (SOT-5); Manufacturer: Texas Instruments; SizeZ_mm: 1.45; SizeX_mm: 2.8; SizeY_mm: 2.9; SizeArea_mm2: 8.12; CompType: IC; U/M: EA; SizeAreaWB_mm2: 14.82; ComponentLink1URL: https://sps06.itg.ti.com/sites/KMS/crossdivteams/altium/docs/ComponentDatasheets/INA180.pdf; Publisher: Texas Instruments; PackageDescription: SOT-5; PackageReference: DBV0005A; LatestRevisionDate: 2017-03-09; Footprint Path 6: C:\AltiumLibraries\Footprints\TI\.PcbLib; MountType: SMT; ComponentLink1Description: Datasheet Link; Alternate Manufacturer: Texas Instruments
U9 = LM5008: LM5008 On-Time DC/DC Buck Switching Regulator; Manufacturer: TI; Description: LM5008 95-V, 350-mA, Constant On-Time DC/DC Buck Switching Regulator; Designer: Erhan YILMAZ; Value: LM5008; Datasheet: http://www.ti.com/lit/ds/symlink/lm5008.pdf

## Nets that join several sheets
3.3V: BLDC_Page1 (38 pins), BLDC_Page2 (C19.2 J4.4 U7.5)
15V: BLDC_Page1 (D7.2 R29.2), BLDC_Page2 (14 pins)
GND: BLDC_Page1 (61 pins), BLDC_Page2 (35 pins)
BEMF_A: BLDC_Page1 (U1.31), BLDC_Page2 (C56.1 J1.3 R40.1 R46.2)
BEMF_B: BLDC_Page1 (U1.30), BLDC_Page2 (C57.1 J2.3 R41.1 R45.2)
BEMF_C: BLDC_Page1 (U1.29), BLDC_Page2 (C58.1 J3.3 R42.1 R44.2)
DC_FB: BLDC_Page1 (U1.21), BLDC_Page2 (C59.1 J4.2 R39.1 R47.2)
IA_IDC: BLDC_Page1 (U1.22), BLDC_Page2 (C23.1 R23.2)
INH_A: BLDC_Page1 (U1.97), BLDC_Page2 (J1.1 U5.2)
INH_B: BLDC_Page1 (U1.98), BLDC_Page2 (J2.1 U6.2)
INH_C: BLDC_Page1 (U1.99), BLDC_Page2 (J3.1 U8.2)
INL_A: BLDC_Page1 (U1.100), BLDC_Page2 (J1.2 U5.3)
INL_B: BLDC_Page1 (U1.1), BLDC_Page2 (J2.2 U6.3)
INL_C: BLDC_Page1 (U1.2), BLDC_Page2 (J3.2 U8.3)
T_Out: BLDC_Page1 (R26.2 U2.2), BLDC_Page2 (J4.3)

## Assembly variants
001: not fitted C13 C14 C15 C20 C22 C46 C47 C48 C49 J1 R1 R2 R3 R5 R7 R8 R9 R13 R17 R36 R37 R38 R40 R41 R42 R44 R45 R46